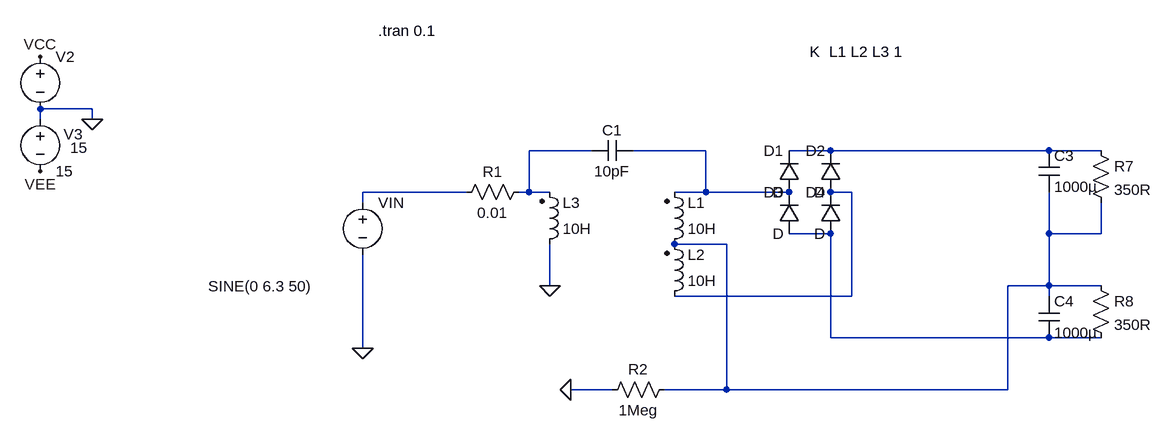
[diagram p0: schematic Draft02.asc]
Draft02.asc, the LTspice schematic file:
Version 4
SHEET 1 2356 680
WIRE -464 -16 -544 -16
WIRE -544 0 -544 -16
WIRE -464 0 -464 -16
WIRE 304 48 208 48
WIRE 480 48 368 48
WIRE 672 48 608 48
WIRE 1008 48 672 48
WIRE 1088 48 1008 48
WIRE 112 112 -48 112
WIRE 208 112 208 48
WIRE 208 112 192 112
WIRE 240 112 208 112
WIRE 480 112 480 48
WIRE 480 112 432 112
WIRE 608 112 480 112
WIRE 704 112 672 112
WIRE -48 128 -48 112
WIRE 672 176 608 176
WIRE 1008 176 1008 112
WIRE 1088 176 1088 128
WIRE 1088 176 1008 176
WIRE 512 192 432 192
WIRE 240 256 240 192
WIRE 1008 256 1008 176
WIRE 1008 256 944 256
WIRE 1088 256 1008 256
WIRE 704 272 704 112
WIRE 704 272 432 272
WIRE 1008 272 1008 256
WIRE 672 336 672 176
WIRE 1008 336 672 336
WIRE 1088 336 1008 336
WIRE -48 352 -48 208
WIRE 336 416 272 416
WIRE 512 416 512 192
WIRE 512 416 416 416
WIRE 944 416 944 256
WIRE 944 416 512 416
FLAG -464 0 0
FLAG -48 352 0
FLAG -544 -96 VCC
FLAG -544 80 VEE
FLAG 240 256 0
FLAG 272 416 0
SYMBOL voltage -48 112 R0
WINDOW 123 0 0 Left 0
WINDOW 39 0 0 Left 0
WINDOW 3 -238 145 Left 2
SYMATTR Value SINE(0 6.3 50)
SYMATTR InstName VIN
SYMBOL voltage -544 -112 R0
WINDOW 123 0 0 Left 0
WINDOW 39 0 0 Left 0
WINDOW 3 46 156 Left 2
SYMATTR Value 15
SYMATTR InstName V2
SYMBOL voltage -544 -16 R0
WINDOW 123 0 0 Left 0
WINDOW 39 0 0 Left 0
WINDOW 0 36 39 Left 2
SYMATTR InstName V3
SYMATTR Value 15
SYMBOL ind2 416 208 M180
WINDOW 0 36 80 Left 2
WINDOW 3 36 40 Left 2
SYMATTR InstName L1
SYMATTR Value 10H
SYMATTR Type ind
SYMBOL diode 624 112 R180
WINDOW 0 24 64 Left 2
WINDOW 3 24 0 Left 2
SYMATTR InstName D1
SYMBOL diode 688 112 R180
WINDOW 0 24 64 Left 2
WINDOW 3 24 0 Left 2
SYMATTR InstName D2
SYMBOL diode 624 176 R180
WINDOW 0 24 64 Left 2
WINDOW 3 24 0 Left 2
SYMATTR InstName D3
SYMBOL diode 688 176 R180
WINDOW 0 24 64 Left 2
WINDOW 3 24 0 Left 2
SYMATTR InstName D4
SYMBOL cap 992 48 R0
SYMATTR InstName C3
SYMATTR Value 1000µ
SYMBOL res 1072 32 R0
SYMATTR InstName R7
SYMATTR Value 350R
SYMBOL ind2 416 288 M180
WINDOW 0 36 80 Left 2
WINDOW 3 36 40 Left 2
SYMATTR InstName L2
SYMATTR Value 10H
SYMATTR Type ind
SYMBOL cap 992 272 R0
SYMATTR InstName C4
SYMATTR Value 1000µ
SYMBOL res 1072 240 R0
SYMATTR InstName R8
SYMATTR Value 350R
SYMBOL ind2 224 208 M180
WINDOW 0 36 80 Left 2
WINDOW 3 36 40 Left 2
SYMATTR InstName L3
SYMATTR Value 10H
SYMATTR Type ind
SYMBOL res 208 96 R90
WINDOW 0 0 56 VBottom 2
WINDOW 3 32 56 VTop 2
SYMATTR InstName R1
SYMATTR Value 0.01
SYMBOL res 432 400 R90
WINDOW 0 0 56 VBottom 2
WINDOW 3 32 56 VTop 2
SYMATTR InstName R2
SYMATTR Value 1Meg
SYMBOL cap 368 32 R90
WINDOW 0 0 32 VBottom 2
WINDOW 3 32 32 VTop 2
SYMATTR InstName C1
SYMATTR Value 10pF
TEXT -24 -136 Left 2 !.tran 0.1
TEXT 640 -104 Left 2 !K  L1 L2 L3 1

The netlist it stands for:
* Draft02.asc
VIN N004 0 SINE(0 6.3 50)
V2 VCC 0 15
V3 0 VEE 15
L1 N007 N002 10H
D1 N002 N003 D
D2 N005 N003 D
D3 N006 N002 D
D4 N006 N005 D
C3 N003 N007 1000µ
R7 N003 N007 350R
L2 N005 N007 10H
C4 N007 N006 1000µ
R8 N007 N006 350R
L3 0 N001 10H
R1 N001 N004 0.01
R2 N007 0 1Meg
C1 N002 N001 10pF
.model D D
.lib standard.dio
.tran 0.1
K  L1 L2 L3 1
.backanno
.end